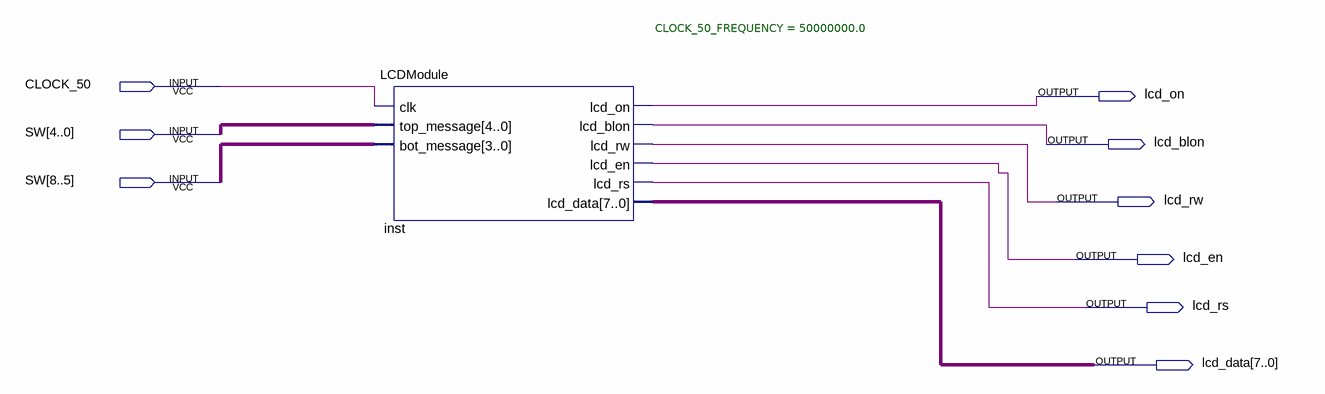
[diagram p0: schematic sheet]
// Quartus schematic fase3.bdf as structural Verilog: 1 symbols, 9 pins
module fase3 (
  input  CLOCK_50,
  input  [8:0] SW,
  output lcd_on,
  output lcd_blon,
  output lcd_rw,
  output lcd_en,
  output lcd_rs,
  output [7:0] lcd_data
);

  LCDModule #(.CLOCK_50_FREQUENCY(50000000.0)) inst (
    .clk(CLOCK_50), .top_message(SW[4:0]), .bot_message(SW[8:5]), .lcd_on(lcd_on), .lcd_blon(lcd_blon),
    .lcd_rw(lcd_rw), .lcd_en(lcd_en), .lcd_rs(lcd_rs), .lcd_data(lcd_data));
endmodule
